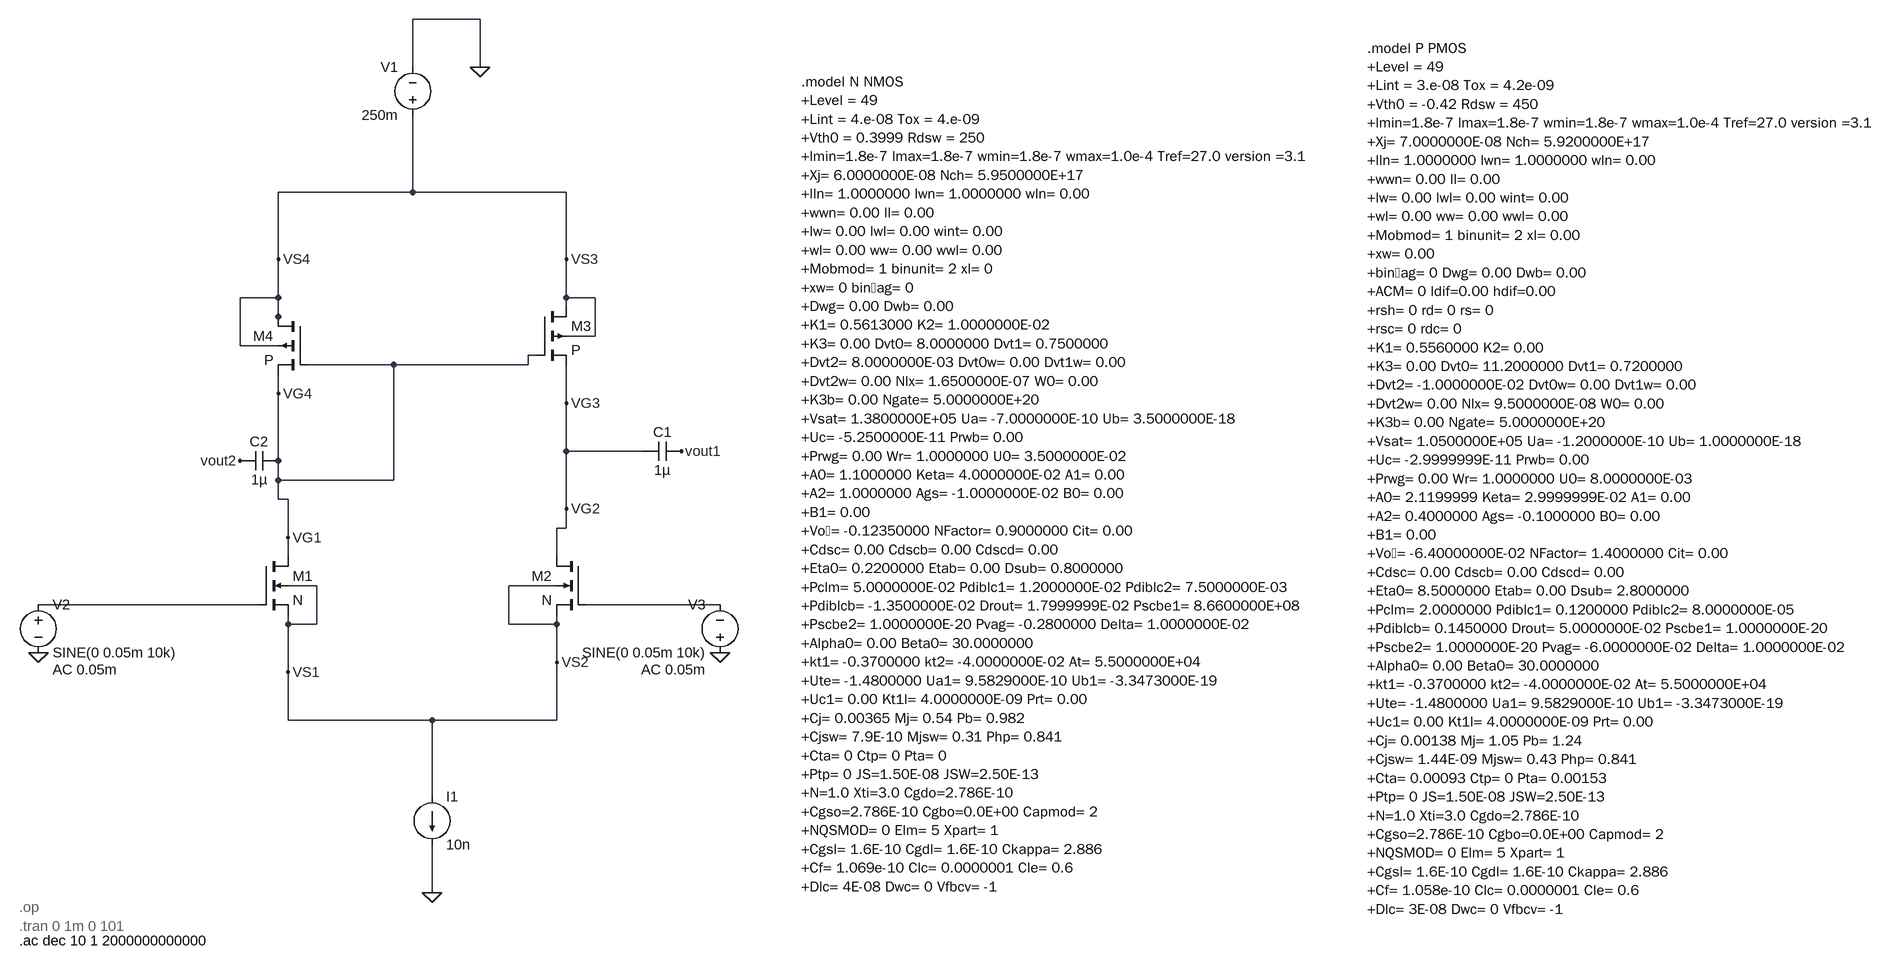
[diagram p0: schematic Draft1.asc]
Draft1.asc, the LTspice schematic file:
Version 4
SHEET 1 2588 1456
WIRE -864 -96 -976 -96
WIRE -976 -16 -976 -96
WIRE -864 -16 -864 -96
WIRE -976 192 -976 64
WIRE -976 192 -1200 192
WIRE -720 192 -976 192
WIRE -1200 304 -1200 192
WIRE -720 304 -720 192
WIRE -1200 368 -1200 304
WIRE -1200 368 -1264 368
WIRE -720 368 -720 304
WIRE -672 368 -720 368
WIRE -720 384 -720 368
WIRE -1200 400 -1200 368
WIRE -1200 416 -1200 400
WIRE -672 432 -672 368
WIRE -672 432 -720 432
WIRE -1264 448 -1264 368
WIRE -1200 448 -1264 448
WIRE -768 464 -784 464
WIRE -1008 480 -1152 480
WIRE -784 480 -784 464
WIRE -784 480 -1008 480
WIRE -1200 528 -1200 496
WIRE -720 544 -720 480
WIRE -720 624 -720 544
WIRE -592 624 -720 624
WIRE -1200 640 -1200 528
WIRE -1200 672 -1200 640
WIRE -1008 672 -1008 480
WIRE -1008 672 -1200 672
WIRE -1200 704 -1200 672
WIRE -1184 704 -1200 704
WIRE -720 720 -720 624
WIRE -720 752 -720 720
WIRE -720 752 -736 752
WIRE -1184 768 -1184 704
WIRE -1184 800 -1184 768
WIRE -736 800 -736 752
WIRE -1136 848 -1184 848
WIRE -736 848 -816 848
WIRE -1232 880 -1600 880
WIRE -464 880 -688 880
WIRE -1184 912 -1184 896
WIRE -1136 912 -1136 848
WIRE -1136 912 -1184 912
WIRE -816 912 -816 848
WIRE -736 912 -736 896
WIRE -736 912 -816 912
WIRE -736 976 -736 912
WIRE -1184 992 -1184 912
WIRE -1184 1072 -1184 992
WIRE -944 1072 -1184 1072
WIRE -736 1072 -736 976
WIRE -736 1072 -944 1072
WIRE -944 1200 -944 1072
WIRE -944 1360 -944 1280
FLAG -944 1360 0
FLAG -864 -16 0
FLAG -1600 960 0
FLAG -464 960 0
FLAG -528 624 vout1
FLAG -1264 640 vout2
FLAG -1184 768 VG1
FLAG -720 720 VG2
FLAG -1184 992 VS1
FLAG -736 976 VS2
FLAG -720 304 VS3
FLAG -1200 304 VS4
FLAG -720 544 VG3
FLAG -1200 528 VG4
SYMBOL nmos4 -1232 800 R0
SYMATTR InstName M1
SYMATTR Value N
SYMATTR Value2 l=900n w=300n
SYMBOL nmos4 -688 800 M0
SYMATTR InstName M2
SYMATTR Value N
SYMATTR Value2 l=900n w=300n
SYMBOL pmos4 -768 384 R0
SYMATTR InstName M3
SYMATTR Value P
SYMATTR Value2 l=1.5u w=600n
SYMBOL pmos4 -1152 400 M0
SYMATTR InstName M4
SYMATTR Value P
SYMATTR Value2 l=1.5u w=600n
SYMBOL current -944 1200 R0
WINDOW 123 0 0 Left 0
WINDOW 39 0 0 Left 0
SYMATTR InstName I1
SYMATTR Value 10n
SYMBOL voltage -976 80 R180
WINDOW 0 24 96 Left 2
WINDOW 3 24 16 Left 2
WINDOW 123 0 0 Left 0
WINDOW 39 0 0 Left 0
SYMATTR InstName V1
SYMATTR Value 250m
SYMBOL cap -528 608 R90
WINDOW 0 0 32 VBottom 2
WINDOW 3 32 32 VTop 2
SYMATTR InstName C1
SYMATTR Value 1µ
SYMBOL voltage -1600 864 R0
WINDOW 123 24 124 Left 2
WINDOW 39 0 0 Left 0
SYMATTR Value2 AC 0.05m
SYMATTR InstName V2
SYMATTR Value SINE(0 0.05m 10k)
SYMBOL voltage -464 976 R180
WINDOW 0 24 96 Left 2
WINDOW 3 24 16 Left 2
WINDOW 123 24 -12 Left 2
WINDOW 39 0 0 Left 0
SYMATTR InstName V3
SYMATTR Value SINE(0 0.05m 10k)
SYMATTR Value2 AC 0.05m
SYMBOL cap -1200 624 R90
WINDOW 0 0 32 VBottom 2
WINDOW 3 32 32 VTop 2
SYMATTR InstName C2
SYMATTR Value 1µ
TEXT 568 8 Left 2 !.model N NMOS\n+Level = 49\n+Lint = 4.e-08 Tox = 4.e-09\n+Vth0 = 0.3999 Rdsw = 250\n+lmin=1.8e-7 lmax=1.8e-7 wmin=1.8e-7 wmax=1.0e-4 Tref=27.0 version =3.1\n+Xj= 6.0000000E-08 Nch= 5.9500000E+17\n+lln= 1.0000000 lwn= 1.0000000 wln= 0.00\n+wwn= 0.00 ll= 0.00\n+lw= 0.00 lwl= 0.00 wint= 0.00\n+wl= 0.00 ww= 0.00 wwl= 0.00\n+Mobmod= 1 binunit= 2 xl= 0\n+xw= 0 binﬂag= 0\n+Dwg= 0.00 Dwb= 0.00\n+K1= 0.5613000 K2= 1.0000000E-02\n+K3= 0.00 Dvt0= 8.0000000 Dvt1= 0.7500000\n+Dvt2= 8.0000000E-03 Dvt0w= 0.00 Dvt1w= 0.00\n+Dvt2w= 0.00 Nlx= 1.6500000E-07 W0= 0.00\n+K3b= 0.00 Ngate= 5.0000000E+20\n+Vsat= 1.3800000E+05 Ua= -7.0000000E-10 Ub= 3.5000000E-18\n+Uc= -5.2500000E-11 Prwb= 0.00\n+Prwg= 0.00 Wr= 1.0000000 U0= 3.5000000E-02\n+A0= 1.1000000 Keta= 4.0000000E-02 A1= 0.00\n+A2= 1.0000000 Ags= -1.0000000E-02 B0= 0.00\n+B1= 0.00\n+Voﬀ= -0.12350000 NFactor= 0.9000000 Cit= 0.00\n+Cdsc= 0.00 Cdscb= 0.00 Cdscd= 0.00\n+Eta0= 0.2200000 Etab= 0.00 Dsub= 0.8000000\n+Pclm= 5.0000000E-02 Pdiblc1= 1.2000000E-02 Pdiblc2= 7.5000000E-03\n+Pdiblcb= -1.3500000E-02 Drout= 1.7999999E-02 Pscbe1= 8.6600000E+08\n+Pscbe2= 1.0000000E-20 Pvag= -0.2800000 Delta= 1.0000000E-02\n+Alpha0= 0.00 Beta0= 30.0000000\n+kt1= -0.3700000 kt2= -4.0000000E-02 At= 5.5000000E+04\n+Ute= -1.4800000 Ua1= 9.5829000E-10 Ub1= -3.3473000E-19\n+Uc1= 0.00 Kt1l= 4.0000000E-09 Prt= 0.00\n+Cj= 0.00365 Mj= 0.54 Pb= 0.982\n+Cjsw= 7.9E-10 Mjsw= 0.31 Php= 0.841\n+Cta= 0 Ctp= 0 Pta= 0\n+Ptp= 0 JS=1.50E-08 JSW=2.50E-13\n+N=1.0 Xti=3.0 Cgdo=2.786E-10\n+Cgso=2.786E-10 Cgbo=0.0E+00 Capmod= 2\n+NQSMOD= 0 Elm= 5 Xpart= 1\n+Cgsl= 1.6E-10 Cgdl= 1.6E-10 Ckappa= 2.886\n+Cf= 1.069e-10 Clc= 0.0000001 Cle= 0.6\n+Dlc= 4E-08 Dwc= 0 Vfbcv= -1
TEXT 1656 -48 Left 2 !.model P PMOS\n+Level = 49\n+Lint = 3.e-08 Tox = 4.2e-09\n+Vth0 = -0.42 Rdsw = 450\n+lmin=1.8e-7 lmax=1.8e-7 wmin=1.8e-7 wmax=1.0e-4 Tref=27.0 version =3.1\n+Xj= 7.0000000E-08 Nch= 5.9200000E+17\n+lln= 1.0000000 lwn= 1.0000000 wln= 0.00\n+wwn= 0.00 ll= 0.00\n+lw= 0.00 lwl= 0.00 wint= 0.00\n+wl= 0.00 ww= 0.00 wwl= 0.00\n+Mobmod= 1 binunit= 2 xl= 0.00\n+xw= 0.00\n+binﬂag= 0 Dwg= 0.00 Dwb= 0.00\n+ACM= 0 ldif=0.00 hdif=0.00\n+rsh= 0 rd= 0 rs= 0\n+rsc= 0 rdc= 0\n+K1= 0.5560000 K2= 0.00\n+K3= 0.00 Dvt0= 11.2000000 Dvt1= 0.7200000\n+Dvt2= -1.0000000E-02 Dvt0w= 0.00 Dvt1w= 0.00\n+Dvt2w= 0.00 Nlx= 9.5000000E-08 W0= 0.00\n+K3b= 0.00 Ngate= 5.0000000E+20\n+Vsat= 1.0500000E+05 Ua= -1.2000000E-10 Ub= 1.0000000E-18\n+Uc= -2.9999999E-11 Prwb= 0.00\n+Prwg= 0.00 Wr= 1.0000000 U0= 8.0000000E-03\n+A0= 2.1199999 Keta= 2.9999999E-02 A1= 0.00\n+A2= 0.4000000 Ags= -0.1000000 B0= 0.00\n+B1= 0.00\n+Voﬀ= -6.40000000E-02 NFactor= 1.4000000 Cit= 0.00\n+Cdsc= 0.00 Cdscb= 0.00 Cdscd= 0.00\n+Eta0= 8.5000000 Etab= 0.00 Dsub= 2.8000000\n+Pclm= 2.0000000 Pdiblc1= 0.1200000 Pdiblc2= 8.0000000E-05\n+Pdiblcb= 0.1450000 Drout= 5.0000000E-02 Pscbe1= 1.0000000E-20\n+Pscbe2= 1.0000000E-20 Pvag= -6.0000000E-02 Delta= 1.0000000E-02\n+Alpha0= 0.00 Beta0= 30.0000000\n+kt1= -0.3700000 kt2= -4.0000000E-02 At= 5.5000000E+04\n+Ute= -1.4800000 Ua1= 9.5829000E-10 Ub1= -3.3473000E-19\n+Uc1= 0.00 Kt1l= 4.0000000E-09 Prt= 0.00\n+Cj= 0.00138 Mj= 1.05 Pb= 1.24\n+Cjsw= 1.44E-09 Mjsw= 0.43 Php= 0.841\n+Cta= 0.00093 Ctp= 0 Pta= 0.00153\n+Ptp= 0 JS=1.50E-08 JSW=2.50E-13\n+N=1.0 Xti=3.0 Cgdo=2.786E-10\n+Cgso=2.786E-10 Cgbo=0.0E+00 Capmod= 2\n+NQSMOD= 0 Elm= 5 Xpart= 1\n+Cgsl= 1.6E-10 Cgdl= 1.6E-10 Ckappa= 2.886\n+Cf= 1.058e-10 Clc= 0.0000001 Cle= 0.6\n+Dlc= 3E-08 Dwc= 0 Vfbcv= -1
TEXT -1632 1384 Left 2 ;.op
TEXT -1632 1416 Left 2 ;.tran 0 1m 0 101
TEXT -1632 1440 Left 2 !.ac dec 10 1 2000000000000

The netlist it stands for:
* Draft1.asc
M1 VG4 N001 VS2 VS2 N l=900n w=300n
M2 VG3 N002 VS2 VS2 N l=900n w=300n
M3 VS4 VG4 VG3 VS4 P l=1.5u w=600n
M4 VS4 VG4 VG4 VS4 P l=1.5u w=600n
I1 VS2 0 10n
V1 VS4 0 250m
C1 vout1 VG3 1µ
V2 N001 0 SINE(0 0.05m 10k) AC 0.05m
V3 0 N002 SINE(0 0.05m 10k) AC 0.05m
C2 VG4 vout2 1µ
.model NMOS NMOS
.model PMOS PMOS
.lib standard.mos
.model N NMOS
+Level = 49
+Lint = 4.e-08 Tox = 4.e-09
+Vth0 = 0.3999 Rdsw = 250
+lmin=1.8e-7 lmax=1.8e-7 wmin=1.8e-7 wmax=1.0e-4 Tref=27.0 version =3.1
+Xj= 6.0000000E-08 Nch= 5.9500000E+17
+lln= 1.0000000 lwn= 1.0000000 wln= 0.00
+wwn= 0.00 ll= 0.00
+lw= 0.00 lwl= 0.00 wint= 0.00
+wl= 0.00 ww= 0.00 wwl= 0.00
+Mobmod= 1 binunit= 2 xl= 0
+xw= 0 binﬂag= 0
+Dwg= 0.00 Dwb= 0.00
+K1= 0.5613000 K2= 1.0000000E-02
+K3= 0.00 Dvt0= 8.0000000 Dvt1= 0.7500000
+Dvt2= 8.0000000E-03 Dvt0w= 0.00 Dvt1w= 0.00
+Dvt2w= 0.00 Nlx= 1.6500000E-07 W0= 0.00
+K3b= 0.00 Ngate= 5.0000000E+20
+Vsat= 1.3800000E+05 Ua= -7.0000000E-10 Ub= 3.5000000E-18
+Uc= -5.2500000E-11 Prwb= 0.00
+Prwg= 0.00 Wr= 1.0000000 U0= 3.5000000E-02
+A0= 1.1000000 Keta= 4.0000000E-02 A1= 0.00
+A2= 1.0000000 Ags= -1.0000000E-02 B0= 0.00
+B1= 0.00
+Voﬀ= -0.12350000 NFactor= 0.9000000 Cit= 0.00
+Cdsc= 0.00 Cdscb= 0.00 Cdscd= 0.00
+Eta0= 0.2200000 Etab= 0.00 Dsub= 0.8000000
+Pclm= 5.0000000E-02 Pdiblc1= 1.2000000E-02 Pdiblc2= 7.5000000E-03
+Pdiblcb= -1.3500000E-02 Drout= 1.7999999E-02 Pscbe1= 8.6600000E+08
+Pscbe2= 1.0000000E-20 Pvag= -0.2800000 Delta= 1.0000000E-02
+Alpha0= 0.00 Beta0= 30.0000000
+kt1= -0.3700000 kt2= -4.0000000E-02 At= 5.5000000E+04
+Ute= -1.4800000 Ua1= 9.5829000E-10 Ub1= -3.3473000E-19
+Uc1= 0.00 Kt1l= 4.0000000E-09 Prt= 0.00
+Cj= 0.00365 Mj= 0.54 Pb= 0.982
+Cjsw= 7.9E-10 Mjsw= 0.31 Php= 0.841
+Cta= 0 Ctp= 0 Pta= 0
+Ptp= 0 JS=1.50E-08 JSW=2.50E-13
+N=1.0 Xti=3.0 Cgdo=2.786E-10
+Cgso=2.786E-10 Cgbo=0.0E+00 Capmod= 2
+NQSMOD= 0 Elm= 5 Xpart= 1
+Cgsl= 1.6E-10 Cgdl= 1.6E-10 Ckappa= 2.886
+Cf= 1.069e-10 Clc= 0.0000001 Cle= 0.6
+Dlc= 4E-08 Dwc= 0 Vfbcv= -1
.model P PMOS
+Level = 49
+Lint = 3.e-08 Tox = 4.2e-09
+Vth0 = -0.42 Rdsw = 450
+lmin=1.8e-7 lmax=1.8e-7 wmin=1.8e-7 wmax=1.0e-4 Tref=27.0 version =3.1
+Xj= 7.0000000E-08 Nch= 5.9200000E+17
+lln= 1.0000000 lwn= 1.0000000 wln= 0.00
+wwn= 0.00 ll= 0.00
+lw= 0.00 lwl= 0.00 wint= 0.00
+wl= 0.00 ww= 0.00 wwl= 0.00
+Mobmod= 1 binunit= 2 xl= 0.00
+xw= 0.00
+binﬂag= 0 Dwg= 0.00 Dwb= 0.00
+ACM= 0 ldif=0.00 hdif=0.00
+rsh= 0 rd= 0 rs= 0
+rsc= 0 rdc= 0
+K1= 0.5560000 K2= 0.00
+K3= 0.00 Dvt0= 11.2000000 Dvt1= 0.7200000
+Dvt2= -1.0000000E-02 Dvt0w= 0.00 Dvt1w= 0.00
+Dvt2w= 0.00 Nlx= 9.5000000E-08 W0= 0.00
+K3b= 0.00 Ngate= 5.0000000E+20
+Vsat= 1.0500000E+05 Ua= -1.2000000E-10 Ub= 1.0000000E-18
+Uc= -2.9999999E-11 Prwb= 0.00
+Prwg= 0.00 Wr= 1.0000000 U0= 8.0000000E-03
+A0= 2.1199999 Keta= 2.9999999E-02 A1= 0.00
+A2= 0.4000000 Ags= -0.1000000 B0= 0.00
+B1= 0.00
+Voﬀ= -6.40000000E-02 NFactor= 1.4000000 Cit= 0.00
+Cdsc= 0.00 Cdscb= 0.00 Cdscd= 0.00
+Eta0= 8.5000000 Etab= 0.00 Dsub= 2.8000000
+Pclm= 2.0000000 Pdiblc1= 0.1200000 Pdiblc2= 8.0000000E-05
+Pdiblcb= 0.1450000 Drout= 5.0000000E-02 Pscbe1= 1.0000000E-20
+Pscbe2= 1.0000000E-20 Pvag= -6.0000000E-02 Delta= 1.0000000E-02
+Alpha0= 0.00 Beta0= 30.0000000
+kt1= -0.3700000 kt2= -4.0000000E-02 At= 5.5000000E+04
+Ute= -1.4800000 Ua1= 9.5829000E-10 Ub1= -3.3473000E-19
+Uc1= 0.00 Kt1l= 4.0000000E-09 Prt= 0.00
+Cj= 0.00138 Mj= 1.05 Pb= 1.24
+Cjsw= 1.44E-09 Mjsw= 0.43 Php= 0.841
+Cta= 0.00093 Ctp= 0 Pta= 0.00153
+Ptp= 0 JS=1.50E-08 JSW=2.50E-13
+N=1.0 Xti=3.0 Cgdo=2.786E-10
+Cgso=2.786E-10 Cgbo=0.0E+00 Capmod= 2
+NQSMOD= 0 Elm= 5 Xpart= 1
+Cgsl= 1.6E-10 Cgdl= 1.6E-10 Ckappa= 2.886
+Cf= 1.058e-10 Clc= 0.0000001 Cle= 0.6
+Dlc= 3E-08 Dwc= 0 Vfbcv= -1
* .op
* .tran 0 1m 0 101
.ac dec 10 1 2000000000000
.backanno
.end